# Altium project PCB_Projectv2.PrjPcb
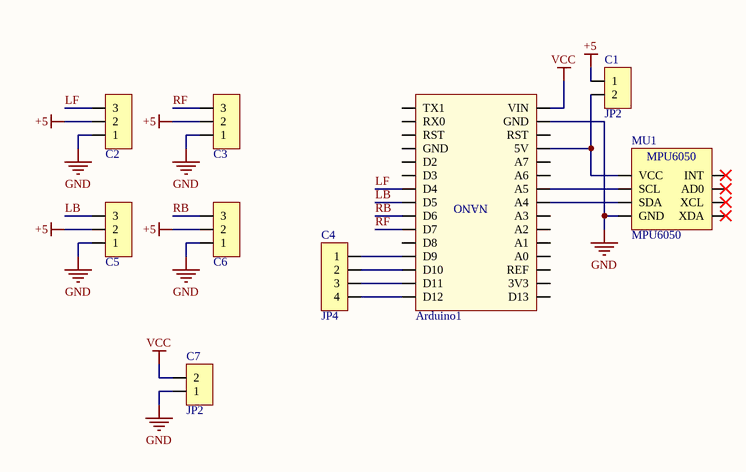
[diagram p0: dronev2.SchDoc]
1 sheet, 9 parts. Net scope: global (net labels, ports and power ports of the same name join across sheets).
Board file: dronev2.PcbDoc

## Sheet dronev2.SchDoc
size A4

### Parts
Arduino1  Arduino Nano  [Arduino Nano]  (value not drawn)
C1  JP2  [JP2-CLOSED]
C2  JP3  [JP3-C1T]  (value not drawn)
C3  JP3  [JP3-C1T]  (value not drawn)
C4  JP4  [JP4-C1T]
C5  JP3  [JP3-C1T]  (value not drawn)
C6  JP3  [JP3-C1T]  (value not drawn)
C7  JP2  [JP2-C1T]
MU1  MPU6050  [MPU6050]

### Nets
+5: C1.1 C2.2 C3.2 C5.2 C6.2
GND: Arduino1.GND C2.1 C3.1 C5.1 C6.1 C7.1 MU1.2(GND)
VCC: Arduino1.VIN C7.2
LB: Arduino1.D5 C5.3
LF: Arduino1.D4 C2.3
RB: Arduino1.D6 C6.3
RF: Arduino1.D7 C3.3
NetArduino1_5V: Arduino1.5V C1.2 MU1.1(VCC)
NetArduino1_A4: Arduino1.A4 MU1.4(SDA)
NetArduino1_A5: Arduino1.A5 MU1.3(SCL)
NetArduino1_D9: Arduino1.D9 C4.1
NetArduino1_D10: Arduino1.D10 C4.2
NetArduino1_D11: Arduino1.D11 C4.3
NetArduino1_D12: Arduino1.D12 C4.4

Not connected (* = marked no-connect by the designer): Arduino1 3V3 A0 A1 A2 A3 A6 A7 D2 D3 D8 D13 REF RST RX0 TX1; MU1 5(XDA)* 6(XCL)* 7(AD0)* 8(INT)*

### Notes on the sheet
- (in symbol Arduino Nano) NANO

### Library data of the parts
Arduino1 = Arduino Nano: Value: Cau 1A
C1 C7 = JP2: WR-PHD 2.54 mm Angled Socket Header; Manufacturer: W¨¹rth Elektronik eiSos GmbH; partNo: 613002143121; ComponentLink1 Description: Manufacturer; ComponentLink2 Description: Datasheet; NoPins: 02; Created Date: 29 March 2013; ComponentLink1URL: http://www.we-online.com; ComponentLink2URL: http://katalog.we-online.de/em/datasheet/6130xx143121.pdf; Created by: Karrer Zheng
C2 C3 C5 C6 = JP3: WR-PHD 2.54 mm Angled Socket Header; Manufacturer: W¨¹rth Elektronik eiSos GmbH; partNo: 613003143121; ComponentLink1 Description: Manufacturer; ComponentLink2 Description: Datasheet; NoPins: 03; Created Date: 29 March 2013; ComponentLink1URL: http://www.we-online.com; ComponentLink2URL: http://katalog.we-online.de/em/datasheet/6130xx143121.pdf; Created by: Karrer Zheng
C4 = JP4: WR-PHD 2.54 mm Angled Socket Header; Manufacturer: W¨¹rth Elektronik eiSos GmbH; partNo: 613004143121; ComponentLink1 Description: Manufacturer; ComponentLink2 Description: Datasheet; NoPins: 04; Created Date: 29 March 2013; ComponentLink1URL: http://www.we-online.com; ComponentLink2URL: http://katalog.we-online.de/em/datasheet/6130xx143121.pdf; Created by: Karrer Zheng
MU1 = MPU6050: Manufacturer: W¨¹rth Elektronik eiSos GmbH; partNo: 613004143121; ComponentLink1 Description: Manufacturer; ComponentLink2 Description: Datasheet; NoPins: 04; Created Date: 29 March 2013; ComponentLink1URL: http://www.we-online.com; ComponentLink2URL: http://katalog.we-online.de/em/datasheet/6130xx143121.pdf; Created by: Karrer Zheng